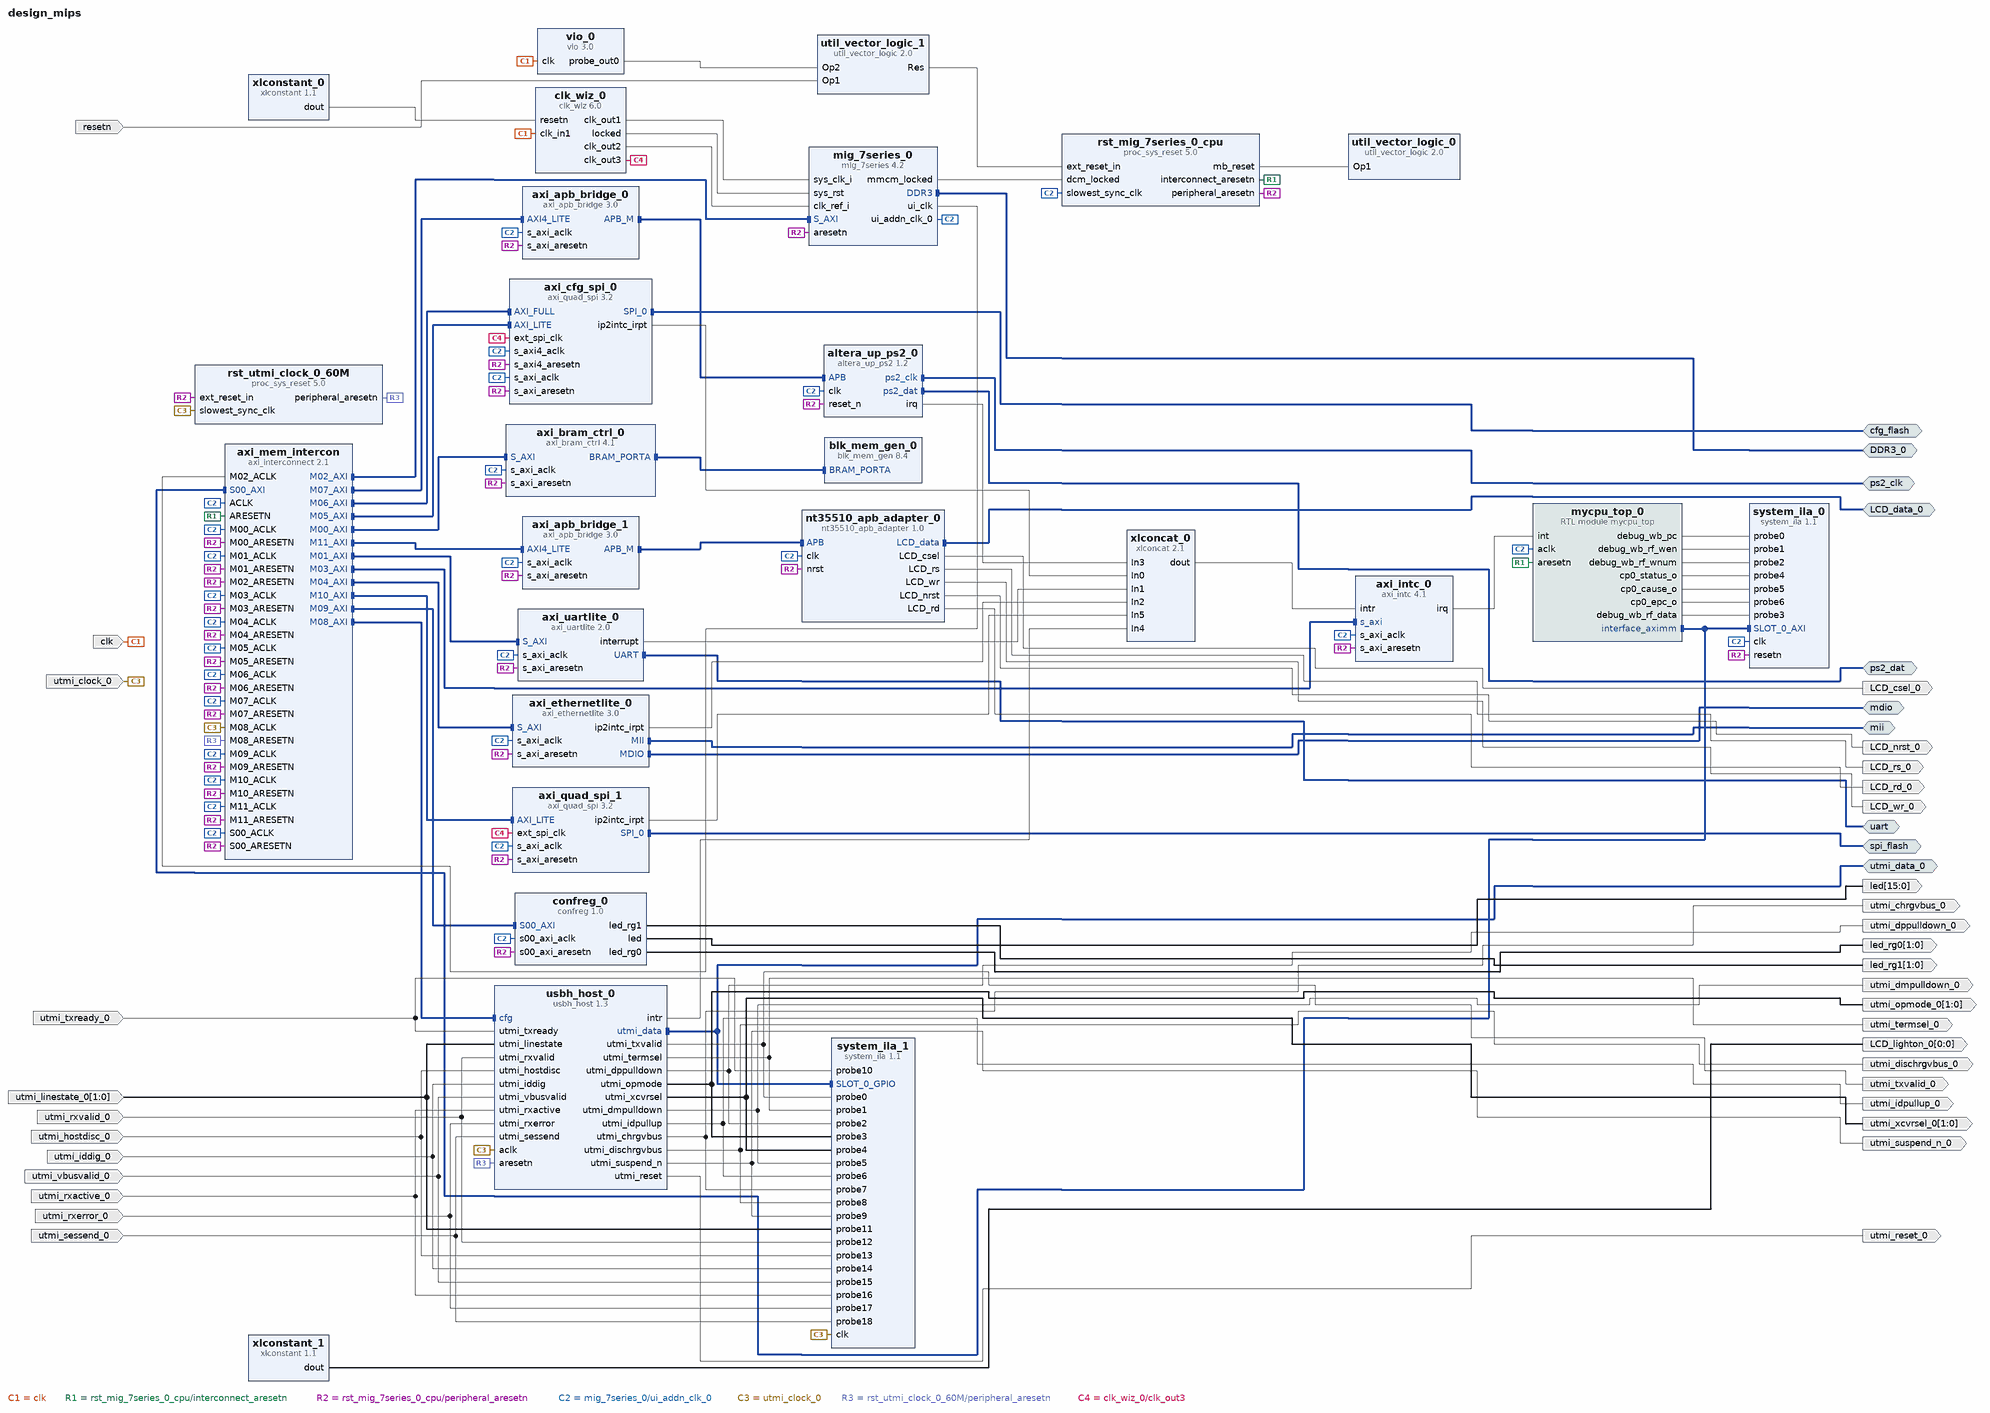
[diagram p0: block diagram of the top level]
# Vivado block design design_mips, xc7a200tfbg676-2, Vivado 2018.3
create_bd_design design_mips

create_bd_intf_port -mode Master -vlnv xilinx.com:interface:uart_rtl:1.0 uart
create_bd_intf_port -mode Master -vlnv xilinx.com:interface:ddrx_rtl:1.0 DDR3_0
create_bd_intf_port -mode Master -vlnv xilinx.com:interface:mii_rtl:1.0 mii
create_bd_intf_port -mode Master -vlnv xilinx.com:interface:mdio_rtl:1.0 mdio
create_bd_intf_port -mode Master -vlnv xilinx.com:interface:spi_rtl:1.0 cfg_flash
create_bd_intf_port -mode Master -vlnv xilinx.com:interface:gpio_rtl:1.0 ps2_clk
create_bd_intf_port -mode Master -vlnv xilinx.com:interface:gpio_rtl:1.0 ps2_dat
create_bd_intf_port -mode Master -vlnv xilinx.com:interface:gpio_rtl:1.0 utmi_data_0
create_bd_intf_port -mode Master -vlnv xilinx.com:interface:spi_rtl:1.0 spi_flash
create_bd_intf_port -mode Master -vlnv xilinx.com:interface:gpio_rtl:1.0 LCD_data_0
create_bd_port -dir I -type clk clk
set_property -dict {CONFIG.ASSOCIATED_RESET resetn} [get_bd_ports clk]
create_bd_port -dir I -type rst resetn
create_bd_port -dir O utmi_txvalid_0
create_bd_port -dir O utmi_termsel_0
create_bd_port -dir O utmi_dppulldown_0
create_bd_port -dir O -type rst utmi_reset_0
create_bd_port -dir O -from 1 -to 0 utmi_opmode_0
create_bd_port -dir O -from 1 -to 0 utmi_xcvrsel_0
create_bd_port -dir O utmi_dmpulldown_0
create_bd_port -dir O utmi_idpullup_0
create_bd_port -dir O utmi_chrgvbus_0
create_bd_port -dir O utmi_dischrgvbus_0
create_bd_port -dir O utmi_suspend_n_0
create_bd_port -dir I utmi_txready_0
create_bd_port -dir I -from 1 -to 0 utmi_linestate_0
create_bd_port -dir I utmi_rxvalid_0
create_bd_port -dir I utmi_hostdisc_0
create_bd_port -dir I utmi_iddig_0
create_bd_port -dir I utmi_vbusvalid_0
create_bd_port -dir I utmi_rxactive_0
create_bd_port -dir I utmi_rxerror_0
create_bd_port -dir I utmi_sessend_0
create_bd_port -dir I -type clk utmi_clock_0
set_property -dict {CONFIG.FREQ_HZ 60000000} [get_bd_ports utmi_clock_0]
create_bd_port -dir O -from 1 -to 0 led_rg1
create_bd_port -dir O -from 1 -to 0 led_rg0
create_bd_port -dir O -from 15 -to 0 led
create_bd_port -dir O LCD_csel_0
create_bd_port -dir O LCD_rs_0
create_bd_port -dir O LCD_wr_0
create_bd_port -dir O LCD_nrst_0
create_bd_port -dir O LCD_rd_0
create_bd_port -dir O -from 0 -to 0 LCD_lighton_0

create_bd_cell -type ip -vlnv xilinx.com:ip:clk_wiz:6.0 clk_wiz_0
set_property -dict [list \
  CONFIG.CLKOUT1_JITTER 130.958 \
  CONFIG.CLKOUT1_PHASE_ERROR 98.575 \
  CONFIG.CLKOUT1_REQUESTED_OUT_FREQ 100.000 \
  CONFIG.CLKOUT2_JITTER 114.829 \
  CONFIG.CLKOUT2_PHASE_ERROR 98.575 \
  CONFIG.CLKOUT2_REQUESTED_OUT_FREQ 200.000 \
  CONFIG.CLKOUT2_USED true \
  CONFIG.CLKOUT3_JITTER 183.243 \
  CONFIG.CLKOUT3_PHASE_ERROR 98.575 \
  CONFIG.CLKOUT3_REQUESTED_OUT_FREQ 20.000 \
  CONFIG.CLKOUT3_USED true \
  CONFIG.MMCM_CLKFBOUT_MULT_F 10.000 \
  CONFIG.MMCM_CLKOUT0_DIVIDE_F 10.000 \
  CONFIG.MMCM_CLKOUT1_DIVIDE 5 \
  CONFIG.MMCM_CLKOUT2_DIVIDE 50 \
  CONFIG.MMCM_DIVCLK_DIVIDE 1 \
  CONFIG.NUM_OUT_CLKS 3 \
  CONFIG.RESET_PORT resetn \
  CONFIG.RESET_TYPE ACTIVE_LOW \
] [get_bd_cells clk_wiz_0]
create_bd_cell -type ip -vlnv xilinx.com:ip:axi_bram_ctrl:4.1 axi_bram_ctrl_0
set_property -dict {CONFIG.SINGLE_PORT_BRAM 1} [get_bd_cells axi_bram_ctrl_0]
create_bd_cell -type ip -vlnv xilinx.com:ip:blk_mem_gen:8.4 blk_mem_gen_0
set_property -dict [list \
  CONFIG.Coe_File ../../../../../../../GuGuMIPS/boot/bootloader.coe \
  CONFIG.EN_SAFETY_CKT true \
  CONFIG.Enable_32bit_Address true \
  CONFIG.Load_Init_File true \
  CONFIG.Memory_Type Single_Port_ROM \
  CONFIG.Port_A_Write_Rate 0 \
  CONFIG.Port_B_Clock 0 \
  CONFIG.Port_B_Enable_Rate 0 \
  CONFIG.Port_B_Write_Rate 0 \
  CONFIG.Register_PortA_Output_of_Memory_Primitives false \
  CONFIG.Use_RSTA_Pin true \
  CONFIG.use_bram_block BRAM_Controller \
] [get_bd_cells blk_mem_gen_0]
create_bd_cell -type ip -vlnv xilinx.com:ip:util_vector_logic:2.0 util_vector_logic_0
set_property -dict {CONFIG.C_OPERATION not CONFIG.C_SIZE 1} [get_bd_cells util_vector_logic_0]
create_bd_cell -type ip -vlnv xilinx.com:ip:axi_uartlite:2.0 axi_uartlite_0
set_property -dict {CONFIG.C_BAUDRATE 115200} [get_bd_cells axi_uartlite_0]
create_bd_cell -type ip -vlnv xilinx.com:ip:system_ila:1.1 system_ila_0
set_property -dict [list \
  CONFIG.C_DATA_DEPTH 8192 \
  CONFIG.C_MON_TYPE MIX \
  CONFIG.C_NUM_MONITOR_SLOTS 1 \
  CONFIG.C_NUM_OF_PROBES 7 \
  CONFIG.C_PROBE0_TYPE 0 \
  CONFIG.C_PROBE1_TYPE 0 \
  CONFIG.C_PROBE2_TYPE 0 \
  CONFIG.C_SLOT_0_APC_EN 0 \
  CONFIG.C_SLOT_0_AXI_AR_SEL_DATA 1 \
  CONFIG.C_SLOT_0_AXI_AR_SEL_TRIG 1 \
  CONFIG.C_SLOT_0_AXI_AW_SEL_DATA 1 \
  CONFIG.C_SLOT_0_AXI_AW_SEL_TRIG 1 \
  CONFIG.C_SLOT_0_AXI_B_SEL_DATA 1 \
  CONFIG.C_SLOT_0_AXI_B_SEL_TRIG 1 \
  CONFIG.C_SLOT_0_AXI_R_SEL_DATA 1 \
  CONFIG.C_SLOT_0_AXI_R_SEL_TRIG 1 \
  CONFIG.C_SLOT_0_AXI_W_SEL_DATA 1 \
  CONFIG.C_SLOT_0_AXI_W_SEL_TRIG 1 \
  CONFIG.C_SLOT_0_INTF_TYPE xilinx.com:interface:aximm_rtl:1.0 \
  CONFIG.C_SLOT_1_APC_EN 0 \
  CONFIG.C_SLOT_1_AXI_AR_SEL_DATA 1 \
  CONFIG.C_SLOT_1_AXI_AR_SEL_TRIG 1 \
  CONFIG.C_SLOT_1_AXI_AW_SEL_DATA 1 \
  CONFIG.C_SLOT_1_AXI_AW_SEL_TRIG 1 \
  CONFIG.C_SLOT_1_AXI_B_SEL_DATA 1 \
  CONFIG.C_SLOT_1_AXI_B_SEL_TRIG 1 \
  CONFIG.C_SLOT_1_AXI_R_SEL_DATA 1 \
  CONFIG.C_SLOT_1_AXI_R_SEL_TRIG 1 \
  CONFIG.C_SLOT_1_AXI_W_SEL_DATA 1 \
  CONFIG.C_SLOT_1_AXI_W_SEL_TRIG 1 \
  CONFIG.C_SLOT_1_INTF_TYPE xilinx.com:interface:aximm_rtl:1.0 \
] [get_bd_cells system_ila_0]
create_bd_cell -type ip -vlnv xilinx.com:ip:xlconstant:1.1 xlconstant_0
set_property -dict {CONFIG.CONST_VAL 1} [get_bd_cells xlconstant_0]
create_bd_cell -type ip -vlnv xilinx.com:ip:mig_7series:4.2 mig_7series_0
set_property -dict [list \
  CONFIG.BOARD_MIG_PARAM Custom \
  CONFIG.RESET_BOARD_INTERFACE Custom \
  CONFIG.XML_INPUT_FILE mig_b.prj \
] [get_bd_cells mig_7series_0]
create_bd_cell -type ip -vlnv xilinx.com:ip:proc_sys_reset:5.0 rst_mig_7series_0_cpu
create_bd_cell -type ip -vlnv xilinx.com:ip:axi_intc:4.1 axi_intc_0
create_bd_cell -type ip -vlnv xilinx.com:ip:axi_ethernetlite:3.0 axi_ethernetlite_0
create_bd_cell -type ip -vlnv xilinx.com:ip:axi_quad_spi:3.2 axi_cfg_spi_0
set_property -dict [list \
  CONFIG.C_SPI_MEMORY 3 \
  CONFIG.C_SPI_MEM_ADDR_BITS 24 \
  CONFIG.C_SPI_MODE 0 \
  CONFIG.C_TYPE_OF_AXI4_INTERFACE 1 \
  CONFIG.C_USE_STARTUP 1 \
  CONFIG.C_XIP_MODE 1 \
] [get_bd_cells axi_cfg_spi_0]
create_bd_cell -type ip -vlnv xilinx.com:ip:xlconcat:2.1 xlconcat_0
set_property -dict {CONFIG.NUM_PORTS 6} [get_bd_cells xlconcat_0]
create_bd_cell -type ip -vlnv xilinx.com:ip:axi_interconnect:2.1 axi_mem_intercon
set_property -dict {CONFIG.NUM_MI 12 CONFIG.NUM_SI 1} [get_bd_cells axi_mem_intercon]
create_bd_cell -type ip -vlnv xilinx.com:ip:axi_apb_bridge:3.0 axi_apb_bridge_0
set_property -dict {CONFIG.C_APB_NUM_SLAVES 1 CONFIG.C_M_APB_PROTOCOL apb4} [get_bd_cells axi_apb_bridge_0]
create_bd_cell -type ip -vlnv user.org:user:altera_up_ps2:1.2 altera_up_ps2_0
set_property -dict {CONFIG.CLK_FREQ 50000000} [get_bd_cells altera_up_ps2_0]
create_bd_cell -type ip -vlnv xilinx.com:ip:proc_sys_reset:5.0 rst_utmi_clock_0_60M
create_bd_cell -type ip -vlnv xilinx.com:ip:vio:3.0 vio_0
set_property -dict {CONFIG.C_NUM_PROBE_IN 0 CONFIG.C_PROBE_OUT0_INIT_VAL 0x1} [get_bd_cells vio_0]
create_bd_cell -type ip -vlnv xilinx.com:ip:util_vector_logic:2.0 util_vector_logic_1
set_property -dict {CONFIG.C_SIZE 1} [get_bd_cells util_vector_logic_1]
create_bd_cell -type ip -vlnv user.org:user:confreg:1.0 confreg_0
create_bd_cell -type ip -vlnv user.org:user:usbh_host:1.3 usbh_host_0
create_bd_cell -type ip -vlnv xilinx.com:ip:axi_quad_spi:3.2 axi_quad_spi_1
set_property -dict [list \
  CONFIG.C_FIFO_DEPTH 256 \
  CONFIG.C_SPI_MEMORY 2 \
  CONFIG.C_SPI_MODE 2 \
  CONFIG.C_TYPE_OF_AXI4_INTERFACE 0 \
  CONFIG.C_USE_STARTUP 0 \
  CONFIG.C_XIP_MODE 0 \
] [get_bd_cells axi_quad_spi_1]
create_bd_cell -type ip -vlnv user.org:user:nt35510_apb_adapter:1.0 nt35510_apb_adapter_0
create_bd_cell -type ip -vlnv xilinx.com:ip:axi_apb_bridge:3.0 axi_apb_bridge_1
set_property -dict {CONFIG.C_APB_NUM_SLAVES 1 CONFIG.C_M_APB_PROTOCOL apb4} [get_bd_cells axi_apb_bridge_1]
create_bd_cell -type ip -vlnv xilinx.com:ip:xlconstant:1.1 xlconstant_1
create_bd_cell -type module -reference mycpu_top mycpu_top_0
create_bd_cell -type ip -vlnv xilinx.com:ip:system_ila:1.1 system_ila_1
set_property -dict [list \
  CONFIG.C_MON_TYPE MIX \
  CONFIG.C_NUM_MONITOR_SLOTS 1 \
  CONFIG.C_NUM_OF_PROBES 19 \
  CONFIG.C_PROBE0_TYPE 0 \
  CONFIG.C_PROBE10_TYPE 0 \
  CONFIG.C_PROBE11_TYPE 0 \
  CONFIG.C_PROBE12_TYPE 0 \
  CONFIG.C_PROBE13_TYPE 0 \
  CONFIG.C_PROBE14_TYPE 0 \
  CONFIG.C_PROBE15_TYPE 0 \
  CONFIG.C_PROBE16_TYPE 0 \
  CONFIG.C_PROBE17_TYPE 0 \
  CONFIG.C_PROBE18_TYPE 0 \
  CONFIG.C_PROBE1_TYPE 0 \
  CONFIG.C_PROBE2_TYPE 0 \
  CONFIG.C_PROBE3_TYPE 0 \
  CONFIG.C_PROBE4_TYPE 0 \
  CONFIG.C_PROBE5_TYPE 0 \
  CONFIG.C_PROBE6_TYPE 0 \
  CONFIG.C_PROBE7_TYPE 0 \
  CONFIG.C_PROBE8_TYPE 0 \
  CONFIG.C_PROBE9_TYPE 0 \
  CONFIG.C_SLOT_0_INTF_TYPE xilinx.com:interface:gpio_rtl:1.0 \
  CONFIG.C_SLOT_0_TYPE 0 \
] [get_bd_cells system_ila_1]

# ---- connections ----

connect_bd_intf_net [get_bd_intf_pins axi_mem_intercon/M02_AXI] [get_bd_intf_pins mig_7series_0/S_AXI]
connect_bd_intf_net [get_bd_intf_ports mii] [get_bd_intf_pins axi_ethernetlite_0/MII]
connect_bd_intf_net [get_bd_intf_ports ps2_dat] [get_bd_intf_pins altera_up_ps2_0/ps2_dat]
connect_bd_intf_net [get_bd_intf_pins axi_bram_ctrl_0/BRAM_PORTA] [get_bd_intf_pins blk_mem_gen_0/BRAM_PORTA]
connect_bd_intf_net [get_bd_intf_pins axi_mem_intercon/M10_AXI] [get_bd_intf_pins axi_quad_spi_1/AXI_LITE]
connect_bd_intf_net -intf_net axi_smc_M00_AXI [get_bd_intf_pins axi_mem_intercon/M00_AXI] [get_bd_intf_pins axi_bram_ctrl_0/S_AXI]
connect_bd_intf_net [get_bd_intf_ports mdio] [get_bd_intf_pins axi_ethernetlite_0/MDIO]
connect_bd_intf_net -intf_net mycpu_top_0_interface_aximm [get_bd_intf_pins mycpu_top_0/interface_aximm] [get_bd_intf_pins axi_mem_intercon/S00_AXI]
connect_bd_intf_net [get_bd_intf_pins mycpu_top_0/interface_aximm] [get_bd_intf_pins system_ila_0/SLOT_0_AXI]
connect_bd_intf_net [get_bd_intf_ports ps2_clk] [get_bd_intf_pins altera_up_ps2_0/ps2_clk]
connect_bd_intf_net [get_bd_intf_pins axi_mem_intercon/M06_AXI] [get_bd_intf_pins axi_cfg_spi_0/AXI_FULL]
connect_bd_intf_net [get_bd_intf_ports uart] [get_bd_intf_pins axi_uartlite_0/UART]
connect_bd_intf_net [get_bd_intf_pins altera_up_ps2_0/APB] [get_bd_intf_pins axi_apb_bridge_0/APB_M]
connect_bd_intf_net [get_bd_intf_pins axi_mem_intercon/M01_AXI] [get_bd_intf_pins axi_uartlite_0/S_AXI]
connect_bd_intf_net [get_bd_intf_pins axi_mem_intercon/M08_AXI] [get_bd_intf_pins usbh_host_0/cfg]
connect_bd_intf_net [get_bd_intf_ports spi_flash] [get_bd_intf_pins axi_quad_spi_1/SPI_0]
connect_bd_intf_net [get_bd_intf_pins axi_mem_intercon/M03_AXI] [get_bd_intf_pins axi_intc_0/s_axi]
connect_bd_intf_net [get_bd_intf_pins axi_mem_intercon/M05_AXI] [get_bd_intf_pins axi_cfg_spi_0/AXI_LITE]
connect_bd_intf_net [get_bd_intf_ports LCD_data_0] [get_bd_intf_pins nt35510_apb_adapter_0/LCD_data]
connect_bd_intf_net [get_bd_intf_pins axi_mem_intercon/M09_AXI] [get_bd_intf_pins confreg_0/S00_AXI]
connect_bd_intf_net -intf_net axi_quad_spi_0_SPI_0 [get_bd_intf_ports cfg_flash] [get_bd_intf_pins axi_cfg_spi_0/SPI_0]
connect_bd_intf_net [get_bd_intf_pins axi_mem_intercon/M07_AXI] [get_bd_intf_pins axi_apb_bridge_0/AXI4_LITE]
connect_bd_intf_net [get_bd_intf_pins axi_mem_intercon/M11_AXI] [get_bd_intf_pins axi_apb_bridge_1/AXI4_LITE]
connect_bd_intf_net [get_bd_intf_pins axi_apb_bridge_1/APB_M] [get_bd_intf_pins nt35510_apb_adapter_0/APB]
connect_bd_intf_net -intf_net usbh_host_0_utmi_data [get_bd_intf_ports utmi_data_0] [get_bd_intf_pins usbh_host_0/utmi_data]
connect_bd_intf_net [get_bd_intf_ports utmi_data_0] [get_bd_intf_pins system_ila_1/SLOT_0_GPIO]
connect_bd_intf_net [get_bd_intf_pins axi_mem_intercon/M04_AXI] [get_bd_intf_pins axi_ethernetlite_0/S_AXI]
connect_bd_intf_net [get_bd_intf_ports DDR3_0] [get_bd_intf_pins mig_7series_0/DDR3]
connect_bd_net -net clk_in1_0_1 [get_bd_ports clk] [get_bd_pins clk_wiz_0/clk_in1] [get_bd_pins vio_0/clk]
connect_bd_net [get_bd_pins xlconstant_0/dout] [get_bd_pins clk_wiz_0/resetn]
connect_bd_net [get_bd_pins mig_7series_0/mmcm_locked] [get_bd_pins rst_mig_7series_0_cpu/dcm_locked]
connect_bd_net [get_bd_pins clk_wiz_0/clk_out1] [get_bd_pins mig_7series_0/sys_clk_i]
connect_bd_net [get_bd_pins rst_mig_7series_0_cpu/mb_reset] [get_bd_pins util_vector_logic_0/Op1]
connect_bd_net [get_bd_pins clk_wiz_0/locked] [get_bd_pins mig_7series_0/sys_rst]
connect_bd_net [get_bd_pins clk_wiz_0/clk_out2] [get_bd_pins mig_7series_0/clk_ref_i]
connect_bd_net -net axi_quad_spi_0_ip2intc_irpt [get_bd_pins axi_cfg_spi_0/ip2intc_irpt] [get_bd_pins xlconcat_0/In0]
connect_bd_net [get_bd_pins axi_uartlite_0/interrupt] [get_bd_pins xlconcat_0/In1]
connect_bd_net [get_bd_pins axi_ethernetlite_0/ip2intc_irpt] [get_bd_pins xlconcat_0/In2]
connect_bd_net [get_bd_pins xlconcat_0/dout] [get_bd_pins axi_intc_0/intr]
connect_bd_net [get_bd_pins mig_7series_0/ui_clk] [get_bd_pins axi_mem_intercon/M02_ACLK]
connect_bd_net -net ARESETN_1 [get_bd_pins rst_mig_7series_0_cpu/interconnect_aresetn] \
  [get_bd_pins axi_mem_intercon/ARESETN] [get_bd_pins mycpu_top_0/aresetn]
connect_bd_net -net rst_mig_7series_0_100M_peripheral_aresetn [get_bd_pins rst_mig_7series_0_cpu/peripheral_aresetn] \
  [get_bd_pins mig_7series_0/aresetn] [get_bd_pins axi_bram_ctrl_0/s_axi_aresetn] [get_bd_pins axi_uartlite_0/s_axi_aresetn] \
  [get_bd_pins system_ila_0/resetn] [get_bd_pins axi_intc_0/s_axi_aresetn] [get_bd_pins axi_ethernetlite_0/s_axi_aresetn] \
  [get_bd_pins axi_cfg_spi_0/s_axi_aresetn] [get_bd_pins axi_mem_intercon/S00_ARESETN] \
  [get_bd_pins axi_mem_intercon/M00_ARESETN] [get_bd_pins axi_mem_intercon/M01_ARESETN] \
  [get_bd_pins axi_mem_intercon/M03_ARESETN] [get_bd_pins axi_mem_intercon/M04_ARESETN] \
  [get_bd_pins axi_mem_intercon/M05_ARESETN] [get_bd_pins axi_mem_intercon/M06_ARESETN] \
  [get_bd_pins axi_mem_intercon/M02_ARESETN] [get_bd_pins axi_mem_intercon/M07_ARESETN] \
  [get_bd_pins axi_apb_bridge_0/s_axi_aresetn] [get_bd_pins altera_up_ps2_0/reset_n] \
  [get_bd_pins rst_utmi_clock_0_60M/ext_reset_in] [get_bd_pins axi_mem_intercon/M09_ARESETN] \
  [get_bd_pins confreg_0/s00_axi_aresetn] [get_bd_pins axi_quad_spi_1/s_axi_aresetn] \
  [get_bd_pins axi_mem_intercon/M10_ARESETN] [get_bd_pins axi_cfg_spi_0/s_axi4_aresetn] \
  [get_bd_pins axi_mem_intercon/M11_ARESETN] [get_bd_pins axi_apb_bridge_1/s_axi_aresetn] \
  [get_bd_pins nt35510_apb_adapter_0/nrst]
connect_bd_net [get_bd_pins mig_7series_0/ui_addn_clk_0] \
  [get_bd_pins axi_uartlite_0/s_axi_aclk] [get_bd_pins axi_bram_ctrl_0/s_axi_aclk] [get_bd_pins system_ila_0/clk] \
  [get_bd_pins rst_mig_7series_0_cpu/slowest_sync_clk] [get_bd_pins axi_intc_0/s_axi_aclk] \
  [get_bd_pins axi_ethernetlite_0/s_axi_aclk] [get_bd_pins axi_cfg_spi_0/s_axi_aclk] [get_bd_pins axi_mem_intercon/ACLK] \
  [get_bd_pins axi_mem_intercon/S00_ACLK] [get_bd_pins axi_mem_intercon/M00_ACLK] [get_bd_pins axi_mem_intercon/M01_ACLK] \
  [get_bd_pins axi_mem_intercon/M03_ACLK] [get_bd_pins axi_mem_intercon/M04_ACLK] [get_bd_pins axi_mem_intercon/M05_ACLK] \
  [get_bd_pins axi_mem_intercon/M06_ACLK] [get_bd_pins axi_mem_intercon/M07_ACLK] [get_bd_pins axi_apb_bridge_0/s_axi_aclk] \
  [get_bd_pins altera_up_ps2_0/clk] [get_bd_pins axi_mem_intercon/M09_ACLK] [get_bd_pins confreg_0/s00_axi_aclk] \
  [get_bd_pins axi_quad_spi_1/s_axi_aclk] [get_bd_pins axi_mem_intercon/M10_ACLK] [get_bd_pins axi_cfg_spi_0/s_axi4_aclk] \
  [get_bd_pins axi_mem_intercon/M11_ACLK] [get_bd_pins axi_apb_bridge_1/s_axi_aclk] [get_bd_pins nt35510_apb_adapter_0/clk] \
  [get_bd_pins mycpu_top_0/aclk]
connect_bd_net [get_bd_pins altera_up_ps2_0/irq] [get_bd_pins xlconcat_0/In3]
connect_bd_net -net usbh_host_0_utmi_txvalid [get_bd_pins usbh_host_0/utmi_txvalid] [get_bd_ports utmi_txvalid_0] [get_bd_pins system_ila_1/probe0]
connect_bd_net -net usbh_host_0_utmi_termsel [get_bd_pins usbh_host_0/utmi_termsel] [get_bd_ports utmi_termsel_0] [get_bd_pins system_ila_1/probe1]
connect_bd_net -net usbh_host_0_utmi_dppulldown [get_bd_pins usbh_host_0/utmi_dppulldown] \
  [get_bd_ports utmi_dppulldown_0] [get_bd_pins system_ila_1/probe2]
connect_bd_net [get_bd_pins usbh_host_0/utmi_reset] [get_bd_ports utmi_reset_0]
connect_bd_net -net usbh_host_0_utmi_opmode [get_bd_pins usbh_host_0/utmi_opmode] [get_bd_ports utmi_opmode_0] [get_bd_pins system_ila_1/probe3]
connect_bd_net -net usbh_host_0_utmi_xcvrsel [get_bd_pins usbh_host_0/utmi_xcvrsel] [get_bd_ports utmi_xcvrsel_0] [get_bd_pins system_ila_1/probe4]
connect_bd_net -net usbh_host_0_utmi_dmpulldown [get_bd_pins usbh_host_0/utmi_dmpulldown] \
  [get_bd_ports utmi_dmpulldown_0] [get_bd_pins system_ila_1/probe5]
connect_bd_net -net usbh_host_0_utmi_idpullup [get_bd_pins usbh_host_0/utmi_idpullup] [get_bd_ports utmi_idpullup_0] [get_bd_pins system_ila_1/probe6]
connect_bd_net -net usbh_host_0_utmi_chrgvbus [get_bd_pins usbh_host_0/utmi_chrgvbus] [get_bd_ports utmi_chrgvbus_0] [get_bd_pins system_ila_1/probe7]
connect_bd_net -net usbh_host_0_utmi_dischrgvbus [get_bd_pins usbh_host_0/utmi_dischrgvbus] \
  [get_bd_ports utmi_dischrgvbus_0] [get_bd_pins system_ila_1/probe8]
connect_bd_net -net usbh_host_0_utmi_suspend_n [get_bd_pins usbh_host_0/utmi_suspend_n] \
  [get_bd_ports utmi_suspend_n_0] [get_bd_pins system_ila_1/probe9]
connect_bd_net -net utmi_txready_0_1 [get_bd_ports utmi_txready_0] [get_bd_pins usbh_host_0/utmi_txready] [get_bd_pins system_ila_1/probe10]
connect_bd_net -net utmi_linestate_0_1 [get_bd_ports utmi_linestate_0] [get_bd_pins usbh_host_0/utmi_linestate] [get_bd_pins system_ila_1/probe11]
connect_bd_net -net utmi_rxvalid_0_1 [get_bd_ports utmi_rxvalid_0] [get_bd_pins usbh_host_0/utmi_rxvalid] [get_bd_pins system_ila_1/probe12]
connect_bd_net -net utmi_hostdisc_0_1 [get_bd_ports utmi_hostdisc_0] [get_bd_pins usbh_host_0/utmi_hostdisc] [get_bd_pins system_ila_1/probe13]
connect_bd_net -net utmi_iddig_0_1 [get_bd_ports utmi_iddig_0] [get_bd_pins usbh_host_0/utmi_iddig] [get_bd_pins system_ila_1/probe14]
connect_bd_net -net utmi_vbusvalid_0_1 [get_bd_ports utmi_vbusvalid_0] [get_bd_pins usbh_host_0/utmi_vbusvalid] [get_bd_pins system_ila_1/probe15]
connect_bd_net -net utmi_rxactive_0_1 [get_bd_ports utmi_rxactive_0] [get_bd_pins usbh_host_0/utmi_rxactive] [get_bd_pins system_ila_1/probe16]
connect_bd_net -net utmi_rxerror_0_1 [get_bd_ports utmi_rxerror_0] [get_bd_pins usbh_host_0/utmi_rxerror] [get_bd_pins system_ila_1/probe17]
connect_bd_net -net utmi_sessend_0_1 [get_bd_ports utmi_sessend_0] [get_bd_pins usbh_host_0/utmi_sessend] [get_bd_pins system_ila_1/probe18]
connect_bd_net -net aclk_0_1 [get_bd_ports utmi_clock_0] \
  [get_bd_pins axi_mem_intercon/M08_ACLK] [get_bd_pins rst_utmi_clock_0_60M/slowest_sync_clk] [get_bd_pins usbh_host_0/aclk] \
  [get_bd_pins system_ila_1/clk]
connect_bd_net [get_bd_pins rst_utmi_clock_0_60M/peripheral_aresetn] [get_bd_pins axi_mem_intercon/M08_ARESETN] [get_bd_pins usbh_host_0/aresetn]
connect_bd_net [get_bd_pins usbh_host_0/intr] [get_bd_pins xlconcat_0/In4]
connect_bd_net [get_bd_ports resetn] [get_bd_pins util_vector_logic_1/Op1]
connect_bd_net [get_bd_pins vio_0/probe_out0] [get_bd_pins util_vector_logic_1/Op2]
connect_bd_net [get_bd_pins util_vector_logic_1/Res] [get_bd_pins rst_mig_7series_0_cpu/ext_reset_in]
connect_bd_net [get_bd_pins confreg_0/led_rg1] [get_bd_ports led_rg1]
connect_bd_net [get_bd_pins confreg_0/led_rg0] [get_bd_ports led_rg0]
connect_bd_net [get_bd_pins confreg_0/led] [get_bd_ports led]
connect_bd_net [get_bd_pins axi_quad_spi_1/ip2intc_irpt] [get_bd_pins xlconcat_0/In5]
connect_bd_net [get_bd_pins clk_wiz_0/clk_out3] [get_bd_pins axi_cfg_spi_0/ext_spi_clk] [get_bd_pins axi_quad_spi_1/ext_spi_clk]
connect_bd_net [get_bd_pins nt35510_apb_adapter_0/LCD_csel] [get_bd_ports LCD_csel_0]
connect_bd_net [get_bd_pins nt35510_apb_adapter_0/LCD_rs] [get_bd_ports LCD_rs_0]
connect_bd_net [get_bd_pins nt35510_apb_adapter_0/LCD_wr] [get_bd_ports LCD_wr_0]
connect_bd_net [get_bd_pins nt35510_apb_adapter_0/LCD_nrst] [get_bd_ports LCD_nrst_0]
connect_bd_net [get_bd_pins nt35510_apb_adapter_0/LCD_rd] [get_bd_ports LCD_rd_0]
connect_bd_net [get_bd_pins xlconstant_1/dout] [get_bd_ports LCD_lighton_0]
connect_bd_net [get_bd_pins mycpu_top_0/debug_wb_pc] [get_bd_pins system_ila_0/probe0]
connect_bd_net [get_bd_pins mycpu_top_0/debug_wb_rf_wen] [get_bd_pins system_ila_0/probe1]
connect_bd_net [get_bd_pins mycpu_top_0/debug_wb_rf_wnum] [get_bd_pins system_ila_0/probe2]
connect_bd_net [get_bd_pins axi_intc_0/irq] [get_bd_pins mycpu_top_0/int]
connect_bd_net [get_bd_pins mycpu_top_0/cp0_status_o] [get_bd_pins system_ila_0/probe4]
connect_bd_net [get_bd_pins mycpu_top_0/cp0_cause_o] [get_bd_pins system_ila_0/probe5]
connect_bd_net [get_bd_pins mycpu_top_0/cp0_epc_o] [get_bd_pins system_ila_0/probe6]
connect_bd_net [get_bd_pins mycpu_top_0/debug_wb_rf_data] [get_bd_pins system_ila_0/probe3]
set_property HDL_ATTRIBUTE.DEBUG true [get_bd_intf_nets mycpu_top_0_interface_aximm]
set_property HDL_ATTRIBUTE.MARK_DEBUG true [get_bd_intf_nets mycpu_top_0_interface_aximm]
set_property HDL_ATTRIBUTE.DEBUG true [get_bd_intf_nets usbh_host_0_utmi_data]
set_property HDL_ATTRIBUTE.MARK_DEBUG true [get_bd_intf_nets usbh_host_0_utmi_data]
set_property HDL_ATTRIBUTE.DEBUG true [get_bd_nets usbh_host_0_utmi_txvalid]
set_property HDL_ATTRIBUTE.MARK_DEBUG true [get_bd_nets usbh_host_0_utmi_txvalid]
set_property HDL_ATTRIBUTE.DEBUG true [get_bd_nets usbh_host_0_utmi_termsel]
set_property HDL_ATTRIBUTE.MARK_DEBUG true [get_bd_nets usbh_host_0_utmi_termsel]
set_property HDL_ATTRIBUTE.DEBUG true [get_bd_nets usbh_host_0_utmi_dppulldown]
set_property HDL_ATTRIBUTE.MARK_DEBUG true [get_bd_nets usbh_host_0_utmi_dppulldown]
set_property HDL_ATTRIBUTE.DEBUG true [get_bd_nets usbh_host_0_utmi_opmode]
set_property HDL_ATTRIBUTE.MARK_DEBUG true [get_bd_nets usbh_host_0_utmi_opmode]
set_property HDL_ATTRIBUTE.DEBUG true [get_bd_nets usbh_host_0_utmi_xcvrsel]
set_property HDL_ATTRIBUTE.MARK_DEBUG true [get_bd_nets usbh_host_0_utmi_xcvrsel]
set_property HDL_ATTRIBUTE.DEBUG true [get_bd_nets usbh_host_0_utmi_dmpulldown]
set_property HDL_ATTRIBUTE.MARK_DEBUG true [get_bd_nets usbh_host_0_utmi_dmpulldown]
set_property HDL_ATTRIBUTE.DEBUG true [get_bd_nets usbh_host_0_utmi_idpullup]
set_property HDL_ATTRIBUTE.MARK_DEBUG true [get_bd_nets usbh_host_0_utmi_idpullup]
set_property HDL_ATTRIBUTE.DEBUG true [get_bd_nets usbh_host_0_utmi_chrgvbus]
set_property HDL_ATTRIBUTE.MARK_DEBUG true [get_bd_nets usbh_host_0_utmi_chrgvbus]
set_property HDL_ATTRIBUTE.DEBUG true [get_bd_nets usbh_host_0_utmi_dischrgvbus]
set_property HDL_ATTRIBUTE.MARK_DEBUG true [get_bd_nets usbh_host_0_utmi_dischrgvbus]
set_property HDL_ATTRIBUTE.DEBUG true [get_bd_nets usbh_host_0_utmi_suspend_n]
set_property HDL_ATTRIBUTE.MARK_DEBUG true [get_bd_nets usbh_host_0_utmi_suspend_n]
set_property HDL_ATTRIBUTE.DEBUG true [get_bd_nets utmi_txready_0_1]
set_property HDL_ATTRIBUTE.MARK_DEBUG true [get_bd_nets utmi_txready_0_1]
set_property HDL_ATTRIBUTE.DEBUG true [get_bd_nets utmi_linestate_0_1]
set_property HDL_ATTRIBUTE.MARK_DEBUG true [get_bd_nets utmi_linestate_0_1]
set_property HDL_ATTRIBUTE.DEBUG true [get_bd_nets utmi_rxvalid_0_1]
set_property HDL_ATTRIBUTE.MARK_DEBUG true [get_bd_nets utmi_rxvalid_0_1]
set_property HDL_ATTRIBUTE.DEBUG true [get_bd_nets utmi_hostdisc_0_1]
set_property HDL_ATTRIBUTE.MARK_DEBUG true [get_bd_nets utmi_hostdisc_0_1]
set_property HDL_ATTRIBUTE.DEBUG true [get_bd_nets utmi_iddig_0_1]
set_property HDL_ATTRIBUTE.MARK_DEBUG true [get_bd_nets utmi_iddig_0_1]
set_property HDL_ATTRIBUTE.DEBUG true [get_bd_nets utmi_vbusvalid_0_1]
set_property HDL_ATTRIBUTE.MARK_DEBUG true [get_bd_nets utmi_vbusvalid_0_1]
set_property HDL_ATTRIBUTE.DEBUG true [get_bd_nets utmi_rxactive_0_1]
set_property HDL_ATTRIBUTE.MARK_DEBUG true [get_bd_nets utmi_rxactive_0_1]
set_property HDL_ATTRIBUTE.DEBUG true [get_bd_nets utmi_rxerror_0_1]
set_property HDL_ATTRIBUTE.MARK_DEBUG true [get_bd_nets utmi_rxerror_0_1]
set_property HDL_ATTRIBUTE.DEBUG true [get_bd_nets utmi_sessend_0_1]
set_property HDL_ATTRIBUTE.MARK_DEBUG true [get_bd_nets utmi_sessend_0_1]

# ---- address map ----
assign_bd_address -offset 0x00000000 -range 128M -target_address_space [get_bd_addr_spaces mycpu_top_0/interface_aximm] [get_bd_addr_segs mig_7series_0/memmap/memaddr]
assign_bd_address -offset 0x1C000000 -range 32M -target_address_space [get_bd_addr_spaces mycpu_top_0/interface_aximm] [get_bd_addr_segs axi_cfg_spi_0/aximm/MEM0]
assign_bd_address -offset 0x1E000000 -range 4K -target_address_space [get_bd_addr_spaces mycpu_top_0/interface_aximm] [get_bd_addr_segs usbh_host_0/cfg/reg0]
assign_bd_address -offset 0x1F600000 -range 64K -target_address_space [get_bd_addr_spaces mycpu_top_0/interface_aximm] [get_bd_addr_segs nt35510_apb_adapter_0/APB/Ctrl]
assign_bd_address -offset 0x1F700000 -range 64K -target_address_space [get_bd_addr_spaces mycpu_top_0/interface_aximm] [get_bd_addr_segs confreg_0/S00_AXI/S00_AXI_reg]
assign_bd_address -offset 0x1F800000 -range 64K -target_address_space [get_bd_addr_spaces mycpu_top_0/interface_aximm] [get_bd_addr_segs altera_up_ps2_0/APB/ctl]
assign_bd_address -offset 0x1F900000 -range 64K -target_address_space [get_bd_addr_spaces mycpu_top_0/interface_aximm] [get_bd_addr_segs axi_quad_spi_1/AXI_LITE/Reg]
assign_bd_address -offset 0x1FA00000 -range 64K -target_address_space [get_bd_addr_spaces mycpu_top_0/interface_aximm] [get_bd_addr_segs axi_cfg_spi_0/AXI_LITE/Reg]
assign_bd_address -offset 0x1FB00000 -range 64K -target_address_space [get_bd_addr_spaces mycpu_top_0/interface_aximm] [get_bd_addr_segs axi_ethernetlite_0/S_AXI/Reg]
assign_bd_address -offset 0x1FC00000 -range 8K -target_address_space [get_bd_addr_spaces mycpu_top_0/interface_aximm] [get_bd_addr_segs axi_bram_ctrl_0/S_AXI/Mem0]
assign_bd_address -offset 0x1FD00000 -range 64K -target_address_space [get_bd_addr_spaces mycpu_top_0/interface_aximm] [get_bd_addr_segs axi_uartlite_0/S_AXI/Reg]
assign_bd_address -offset 0x1FE00000 -range 64K -target_address_space [get_bd_addr_spaces mycpu_top_0/interface_aximm] [get_bd_addr_segs axi_intc_0/S_AXI/Reg]

validate_bd_design
save_bd_design
